# Altium schematic sheet LED.SchDoc: Светодиоды. Нагрузка.
size 420 x 297 mm; Organization: DIY; Address1: L3, 12a Rodborough Rd; Address2: Frenchs Forest; Address3: NSW; Address4: Australia 2086; SheetNumber: 1; SheetTotal: 1; PageSetup: Record=PageOptions|CenterHorizontal=False|CenterVertical=False|PrintScale=1.00|XCorrection=1.00|YCorrection=1.00|PrintKind=2|BorderSize=5000000|LeftOffset=0|BottomOffset=0|Orientation=1|PaperLength=1000|PaperWidth=1000|Scale=100|PaperSource=7|PrintQuality=-4|MediaType=1|DitherType=10|PrintScaleMode=0|PaperKind=A4|PaperIndex=9; Document: Схема блока; FirstReference: xxxx.42; Scale: 1:1; Email: d.vetutnev@gmail.com; ProjectName: УСТРОЙСТВО
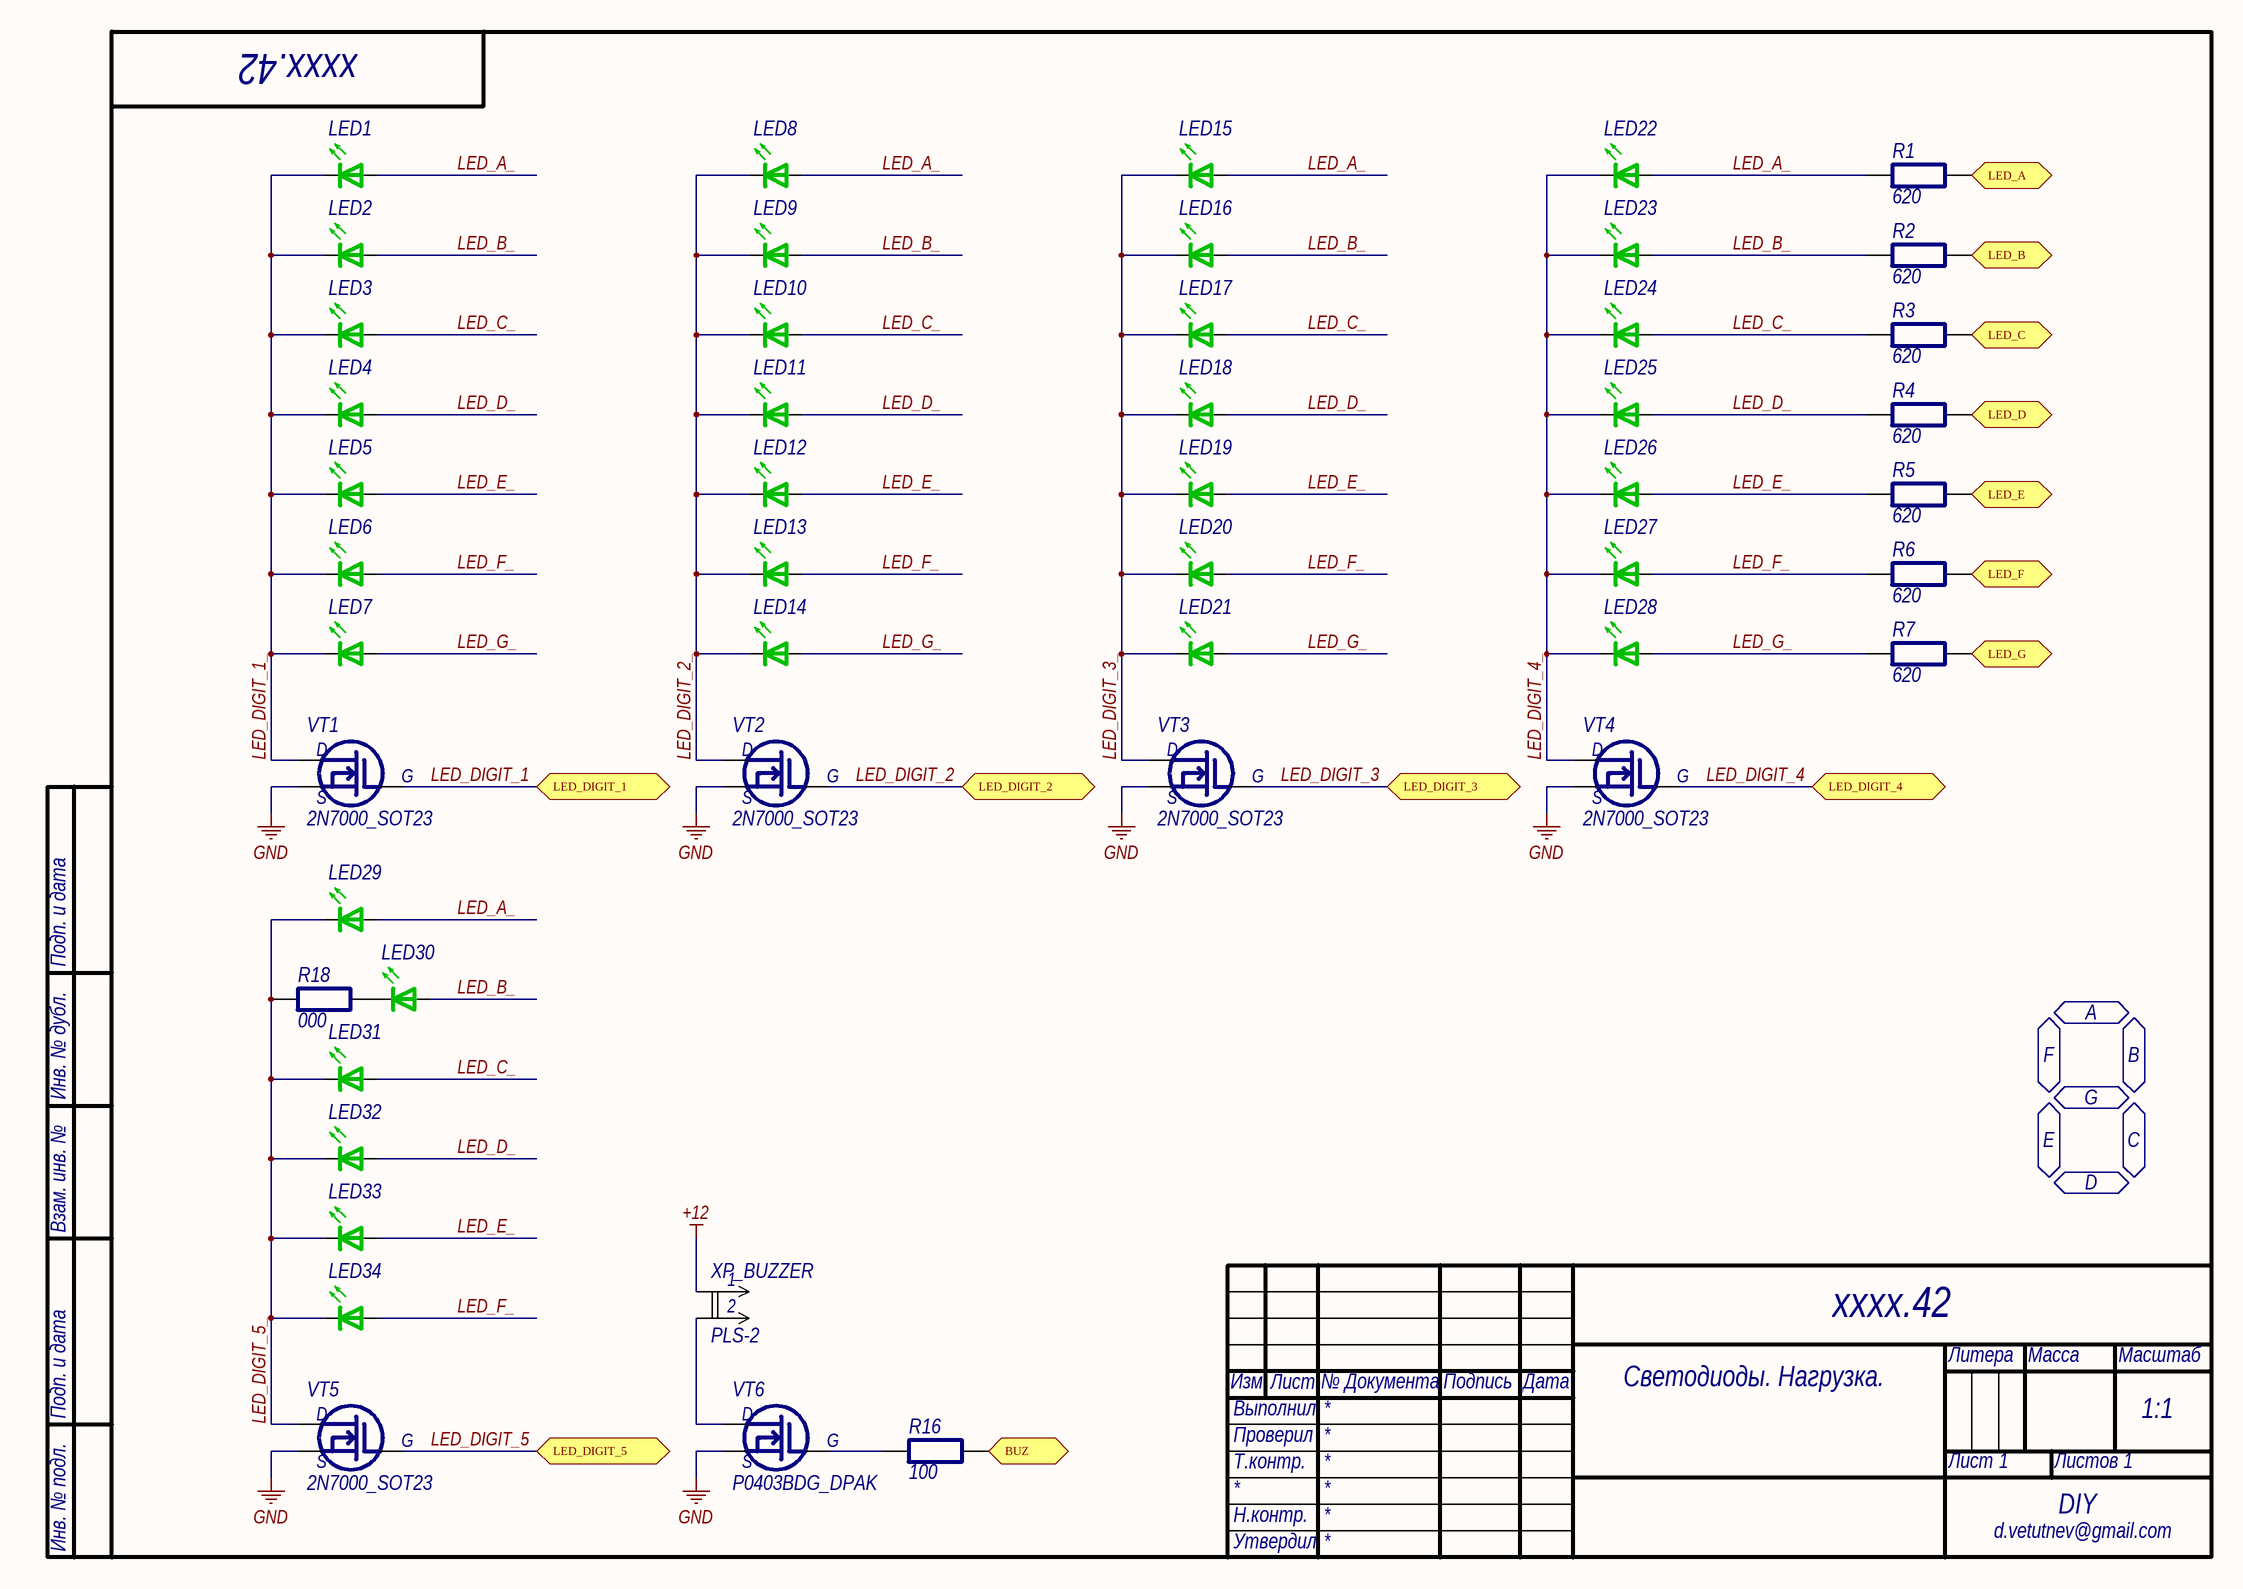
[diagram p0: LED.SchDoc]

## Parts
LED1  Green 0805  [CD2012-0805 - Green]  (value not drawn)
LED2  Green 0805  [CD2012-0805 - Green]  (value not drawn)
LED3  Green 0805  [CD2012-0805 - Green]  (value not drawn)
LED4  Green 0805  [CD2012-0805 - Green]  (value not drawn)
LED5  Green 0805  [CD2012-0805 - Green]  (value not drawn)
LED6  Green 0805  [CD2012-0805 - Green]  (value not drawn)
LED7  Green 0805  [CD2012-0805 - Green]  (value not drawn)
LED8  Green 0805  [CD2012-0805 - Green]  (value not drawn)
LED9  Green 0805  [CD2012-0805 - Green]  (value not drawn)
LED10  Green 0805  [CD2012-0805 - Green]  (value not drawn)
LED11  Green 0805  [CD2012-0805 - Green]  (value not drawn)
LED12  Green 0805  [CD2012-0805 - Green]  (value not drawn)
LED13  Green 0805  [CD2012-0805 - Green]  (value not drawn)
LED14  Green 0805  [CD2012-0805 - Green]  (value not drawn)
LED15  Green 0805  [CD2012-0805 - Green]  (value not drawn)
LED16  Green 0805  [CD2012-0805 - Green]  (value not drawn)
LED17  Green 0805  [CD2012-0805 - Green]  (value not drawn)
LED18  Green 0805  [CD2012-0805 - Green]  (value not drawn)
LED19  Green 0805  [CD2012-0805 - Green]  (value not drawn)
LED20  Green 0805  [CD2012-0805 - Green]  (value not drawn)
LED21  Green 0805  [CD2012-0805 - Green]  (value not drawn)
LED22  Green 0805  [CD2012-0805 - Green]  (value not drawn)
LED23  Green 0805  [CD2012-0805 - Green]  (value not drawn)
LED24  Green 0805  [CD2012-0805 - Green]  (value not drawn)
LED25  Green 0805  [CD2012-0805 - Green]  (value not drawn)
LED26  Green 0805  [CD2012-0805 - Green]  (value not drawn)
LED27  Green 0805  [CD2012-0805 - Green]  (value not drawn)
LED28  Green 0805  [CD2012-0805 - Green]  (value not drawn)
LED29  Green 0805  [CD2012-0805 - Green]  (value not drawn)
LED30  Green 0805  [CD2012-0805 - Green]  (value not drawn)
LED31  Green 0805  [CD2012-0805 - Green]  (value not drawn)
LED32  Green 0805  [CD2012-0805 - Green]  (value not drawn)
LED33  Green 0805  [CD2012-0805 - Green]  (value not drawn)
LED34  Green 0805  [CD2012-0805 - Green]  (value not drawn)
R1  620  [RESC2012M]
R2  620  [RESC2012M]
R3  620  [RESC2012M]
R4  620  [RESC2012M]
R5  620  [RESC2012M]
R6  620  [RESC2012M]
R7  620  [RESC2012M]
R16  100  [RESC2012M]
R18  000  [RESC3216M]
VT1  2N7000_SOT23  [SOT23]
VT2  2N7000_SOT23  [SOT23]
VT3  2N7000_SOT23  [SOT23]
VT4  2N7000_SOT23  [SOT23]
VT5  2N7000_SOT23  [SOT23]
VT6  P0403BDG_DPAK  [DPAK(TO252)]
XP_BUZZER  PLS-2  [PLS-2]

## Ports
BUZ, LED_A, LED_B, LED_C, LED_D, LED_DIGIT_1, LED_DIGIT_2, LED_DIGIT_3, LED_DIGIT_4, LED_DIGIT_5, LED_E, LED_F, LED_G

## Nets
+12: XP_BUZZER.1
GND: VT1.2(S) VT2.2(S) VT3.2(S) VT4.2(S) VT5.2(S) VT6.3(S)
BUZ: R16.2 ; port BUZ
LED_A: R1.2 ; port LED_A
LED_A_: LED1.1 LED8.1 LED15.1 LED22.1 LED29.1 R1.1
LED_B: R2.2 ; port LED_B
LED_B_: LED2.1 LED9.1 LED16.1 LED23.1 LED30.1 R2.1
LED_C: R3.2 ; port LED_C
LED_C_: LED3.1 LED10.1 LED17.1 LED24.1 LED31.1 R3.1
LED_D: R4.2 ; port LED_D
LED_D_: LED4.1 LED11.1 LED18.1 LED25.1 LED32.1 R4.1
LED_DIGIT_1: VT1.1(G) ; port LED_DIGIT_1
LED_DIGIT_1_: LED1.2 LED2.2 LED3.2 LED4.2 LED5.2 LED6.2 LED7.2 VT1.3(D)
LED_DIGIT_2: VT2.1(G) ; port LED_DIGIT_2
LED_DIGIT_2_: LED8.2 LED9.2 LED10.2 LED11.2 LED12.2 LED13.2 LED14.2 VT2.3(D)
LED_DIGIT_3: VT3.1(G) ; port LED_DIGIT_3
LED_DIGIT_3_: LED15.2 LED16.2 LED17.2 LED18.2 LED19.2 LED20.2 LED21.2 VT3.3(D)
LED_DIGIT_4: VT4.1(G) ; port LED_DIGIT_4
LED_DIGIT_4_: LED22.2 LED23.2 LED24.2 LED25.2 LED26.2 LED27.2 LED28.2 VT4.3(D)
LED_DIGIT_5: VT5.1(G) ; port LED_DIGIT_5
LED_DIGIT_5_: LED29.2 LED31.2 LED32.2 LED33.2 LED34.2 R18.1 VT5.3(D)
LED_E: R5.2 ; port LED_E
LED_E_: LED5.1 LED12.1 LED19.1 LED26.1 LED33.1 R5.1
LED_F: R6.2 ; port LED_F
LED_F_: LED6.1 LED13.1 LED20.1 LED27.1 LED34.1 R6.1
LED_G: R7.2 ; port LED_G
LED_G_: LED7.1 LED14.1 LED21.1 LED28.1 R7.1
NetLED30_2: LED30.2 R18.2
NetR16_1: R16.1 VT6.1(G)
NetVT6_4: VT6.4(D) XP_BUZZER.2

## Notes on the sheet
- F
- A
- B
- E
- G
- C
- D
- Подп. и дата
- Инв. № дубл.
- Взам. инв. №
- Изм
- Выполнил
- Лист
- № Документа
- Подпись
- Дата
- Литера
- Масса
- Масштаб
- Проверил
- Т.контр.
- Листов
- Н.контр.
- Утвердил
- Инв. № подл.

## Library data of the parts
LED1-LED34 = LED_Green_0805: PartNumber: Green 0805
R1-R7 R16 = Res_0805: PartNumber: SMD 0805
  R1-R7: Value: 620
  R16: Value: 100
R18 = Res_1206: PartNumber: SMD 1206; Value: 000
VT1-VT5 = 2N7000_SOT23: PartNumber: 2N7000_SOT23
VT6 = P0403BDG_DPAK: PartNumber: P0403BDG_DPAK
XP_BUZZER = PLS-2: PartNumber: PLS-2